# Altium schematic sheet 6P_JST-PH_EXT.SchDoc
size A4
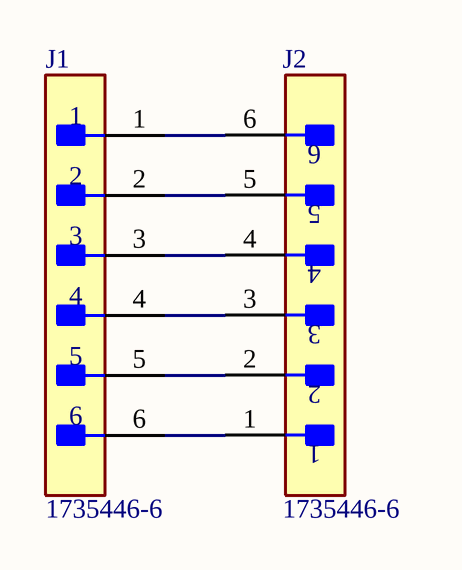
[diagram p0: 6P_JST-PH_EXT.SchDoc]

## Parts
J1  1735446-6  [FP-1735446-6-MFG]
J2  1735446-6  [FP-1735446-6-MFG]

## Nets
NetJ1_1: J1.1 J2.6
NetJ1_2: J1.2 J2.5
NetJ1_3: J1.3 J2.4
NetJ1_4: J1.4 J2.3
NetJ1_5: J1.5 J2.2
NetJ1_6: J1.6 J2.1

## Library data of the parts
J1 J2 = CMP-03369-000087-1: CONN HEADER VERT 6POS 2MM; Manufacturer: TE; Conn Gender: Male; Conn Orientation: Vertical; Current Rating: 3A; Voltage Rating: 100V; Number Of Contacts: 6; Device Class L1: Connectors; RoHS: TRUE; Pitch: 2mm; Number Of Rows: 1; Device Class L2: Headers and Wire Housings; Digikey Description: CONN HEADER VERT 6POS 2MM; Category: Conn; Automotive: No; Device Class L3: unset; Lead Free: Yes; Package: 1735446-6; Height: 6.37mm; Temperature: -25°C to +85°C; Contact Material: Tin,Nickel; Mouser Description: Headers & Wire Housings 6 POS HDR VERT 2.0mm; Octopart: https://octopart.com/1735446-6-te+connectivity-42205942; Temperature Range High: +85°C; ComponentLink2URL: https://www.te.com/usa-en/product-1735446-6.html; ComponentLink2Description: Datasheet; Temperature Range Low: -25°C; Manufacturer Part Number: 1735446-6